# Altium schematic sheet MCU.SchDoc
size B
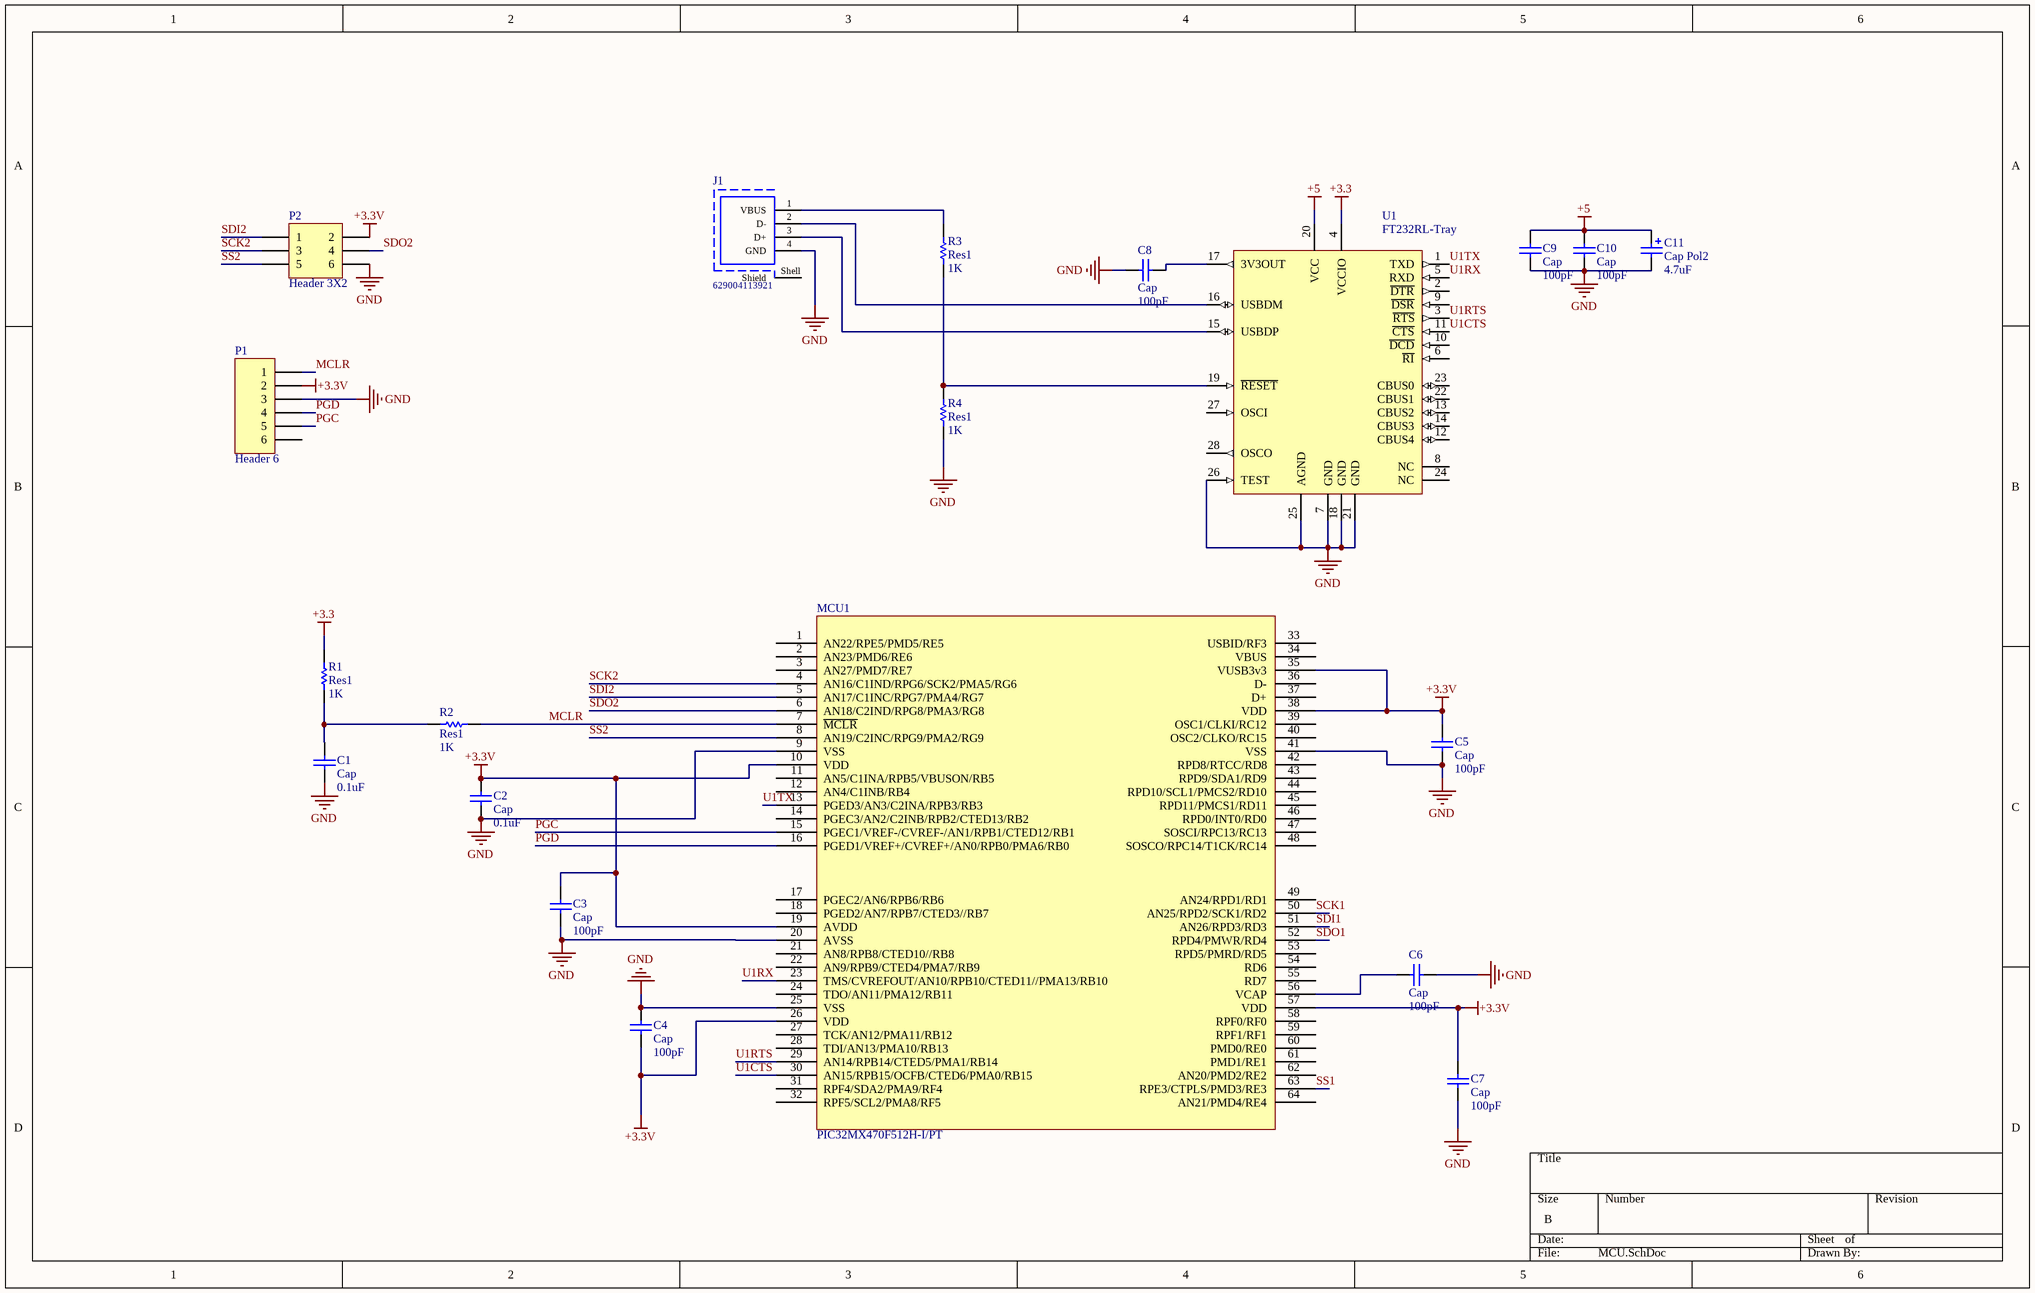
[diagram p0: MCU.SchDoc]

## Parts
C1  Cap  value 0.1uF  [RAD-0.3]
C2  Cap  value 0.1uF  [RAD-0.3]
C3  Cap  value 100pF  [RAD-0.3]
C4  Cap  value 100pF  [RAD-0.3]
C5  Cap  value 100pF  [RAD-0.3]
C6  Cap  value 100pF  [RAD-0.3]
C7  Cap  value 100pF  [RAD-0.3]
C8  Cap  value 100pF  [RAD-0.3]
C9  Cap  value 100pF  [RAD-0.3]
C10  Cap  value 100pF  [RAD-0.3]
C11  Cap Pol2  value 4.7uF  [POLAR0.8]
J1  629004113921  [629004113921]
MCU1  PIC32MX470F512H-I/PT  [*QFP50P1200X1200X120-64N]
P1  Header 6  [HDR1X6]
P2  Header 3X2  [HDR2X3]
R1  Res1  value 1K  [AXIAL-0.3]
R2  Res1  value 1K  [AXIAL-0.3]
R3  Res1  value 1K  [AXIAL-0.3]
R4  Res1  value 1K  [AXIAL-0.3]
U1  FT232RL-Tray  [SSOP-28_L]

## Nets
+3.3: R1.2 U1.4(VCCIO)
+3.3V: C2.2 C3.2 C4.2 C5.2 C7.1 MCU1.10(VDD) MCU1.19(AVDD) MCU1.26(VDD) MCU1.35(VUSB3v3) MCU1.38(VDD) MCU1.57(VDD) P1.2 P2.2
+5: C9.2 C10.2 C11.1 U1.20(VCC)
GND: C1.1 C2.1 C3.1 C4.1 C5.1 C6.2 C7.2 C8.1 C9.1 C10.1 C11.2 J1.4(GND) MCU1.9(VSS) MCU1.20(AVSS) MCU1.25(VSS) MCU1.41(VSS) P1.3 P2.6 R4.2 U1.7(GND) U1.18(GND) U1.21(GND) U1.25(AGND) U1.26(TEST)
MCLR: MCU1.7(~{MCLR}) P1.1 R2.1
PGC: MCU1.15(PGEC1/VREF-/CVREF-/AN1/RPB1/CTED12/RB1) P1.5
PGD: MCU1.16(PGED1/VREF+/CVREF+/AN0/RPB0/PMA6/RB0) P1.4
SCK1: MCU1.50(AN25/RPD2/SCK1/RD2)
SCK2: MCU1.4(AN16/C1IND/RPG6/SCK2/PMA5/RG6) P2.3
SDI1: MCU1.51(AN26/RPD3/RD3)
SDI2: MCU1.5(AN17/C1INC/RPG7/PMA4/RG7) P2.1
SDO1: MCU1.52(RPD4/PMWR/RD4)
SDO2: MCU1.6(AN18/C2IND/RPG8/PMA3/RG8) P2.4
SS1: MCU1.63(RPE3/CTPLS/PMD3/RE3)
SS2: MCU1.8(AN19/C2INC/RPG9/PMA2/RG9) P2.5
U1CTS: MCU1.30(AN15/RPB15/OCFB/CTED6/PMA0/RB15) U1.11(~{CTS})
U1RTS: MCU1.29(AN14/RPB14/CTED5/PMA1/RB14) U1.3(~{RTS})
U1RX: MCU1.23(TMS/CVREFOUT/AN10/RPB10/CTED11//PMA13/RB10) U1.5(RXD)
U1TX: MCU1.13(PGED3/AN3/C2INA/RPB3/RB3) U1.1(TXD)
NetC1_2: C1.2 R1.1 R2.2
NetC6_1: C6.1 MCU1.56(VCAP)
NetC8_2: C8.2 U1.17(3V3OUT)
NetJ1_1: J1.1(VBUS) R3.1
NetJ1_2: J1.2(D-) U1.16(USBDM)
NetJ1_3: J1.3(D+) U1.15(USBDP)
NetR3_2: R3.2 R4.1 U1.19(~{RESET})

Not connected (* = marked no-connect by the designer): J1 Shell(Shield); MCU1 1(AN22/RPE5/PMD5/RE5) 2(AN23/PMD6/RE6) 3(AN27/PMD7/RE7) 11(AN5/C1INA/RPB5/VBUSON/RB5) 12(AN4/C1INB/RB4) 14(PGEC3/AN2/C2INB/RPB2/CTED13/RB2) 17(PGEC2/AN6/RPB6/RB6) 18(PGED2/AN7/RPB7/CTED3//RB7) 21(AN8/RPB8/CTED10//RB8) 22(AN9/RPB9/CTED4/PMA7/RB9) 24(TDO/AN11/PMA12/RB11) 27(TCK/AN12/PMA11/RB12) 28(TDI/AN13/PMA10/RB13) 31(RPF4/SDA2/PMA9/RF4) 32(RPF5/SCL2/PMA8/RF5) 33(USBID/RF3) 34(VBUS) 36(D-) 37(D+) 39(OSC1/CLKI/RC12) 40(OSC2/CLKO/RC15) 42(RPD8/RTCC/RD8) 43(RPD9/SDA1/RD9) 44(_RPD10/SCL1/PMCS2/RD10) 45(RPD11/PMCS1/RD11) 46(RPD0/INT0/RD0) 47(SOSCI/RPC13/RC13) 48(SOSCO/RPC14/T1CK/RC14) 49(_AN24/RPD1/RD1) 53(RPD5/PMRD/RD5) 54(RD6) 55(RD7) 58(_RPF0/RF0) 59(RPF1/RF1) 60(PMD0/RE0) 61(PMD1/RE1) 62(AN20/PMD2/RE2) 64(AN21/PMD4/RE4); P1 6; U1 2(~{DTR}) 6(~{RI}) 8(NC) 9(~{DSR}) 10(~{DCD}) 12(CBUS4) 13(CBUS2) 14(CBUS3) 22(CBUS1) 23(CBUS0) 24(NC) 27(OSCI) 28(OSCO)

## Library data of the parts
C1-C10 = Cap: Capacitor; Published: 8-Jun-2000; LatestRevisionDate: 17-Jul-2002; LatestRevisionNote: Re-released for DXP Platform.; PackageReference: RAD-0.3; Publisher: Altium Limited; PackageDescription: Radial Cap, Thru-Hole; 2 Leads; 0.3 in Pin Spacing
C11 = Cap Pol2: Polarized Capacitor (Axial); Published: 8-Jun-2000; LatestRevisionDate: 17-Jul-2002; LatestRevisionNote: Re-released for DXP Platform.; PackageReference: POLAR0.8; Publisher: Altium Limited; PackageDescription: Polarized Capacitor; 2 Leads
J1 = CMP-1502-03242-1: USB 2.0 Type A Plug WR-COM, Horizontal, SMT, with Clips; Manufacturer: Wurth Elektronik; Contact Resistance: 20mOhm; Working Voltage: 30VAC; Rated Current: 1.5A; Packaging: Tube; Operating Temperature: -40to105degC; Manufacturer URL: http://www.we-online.de; Orientation: Horizontal; Datasheet URL: https://katalog.we-online.de/em/datasheet/629004113921.pdf; Package Reference: 629004113921; Mounting Technology: SMT; Gender: Plug; Publisher: WurthElektronik; Part Number: 629004113921; Connector Type: USB2.0TypeA
P1 = Header 6: Header, 6-Pin; LatestRevisionDate: 17-Jul-2002; LatestRevisionNote: Re-released for DXP Platform.; Publisher: Altium Limited
P2 = Header 3X2: Header, 3-Pin, Dual row; LatestRevisionDate: 17-Jul-2002; LatestRevisionNote: Re-released for DXP Platform.; Publisher: Altium Limited
R1-R4 = Res1: Resistor; Published: 8-Jun-2000; LatestRevisionDate: 17-Jul-2002; LatestRevisionNote: Re-released for DXP Platform.; PackageReference: AXIAL-0.3; Publisher: Altium Limited; PackageDescription: Axial Device, Thru-Hole; 2 Leads; 0.3 in Pin Spacing
U1 = CMP-0078-00027-1: USB UART Asynchronous Serial Data Transfer Chip, SSOP-28, Tray; DatasheetVersion: ver 2.07, Jul-2010; PackageVersion: 2010; PackageReference: SSOP-28; PackageDescription: 28-Pin Small Outline Package 0.65 mm Pitch